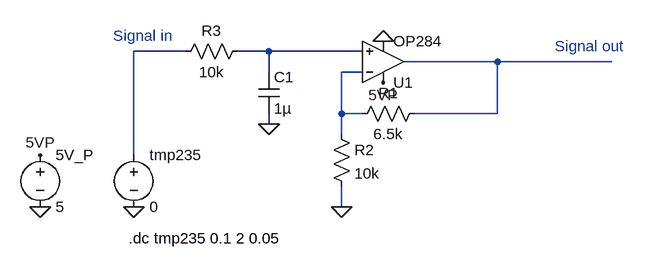
[diagram p0: schematic tmp235.asc]
tmp235.asc, the LTspice schematic file:
Version 4
SHEET 1 880 680
WIRE 80 48 0 48
WIRE 208 48 160 48
WIRE 352 48 208 48
WIRE 560 64 416 64
WIRE 736 64 560 64
WIRE 208 80 208 48
WIRE 352 80 320 80
WIRE 320 144 320 80
WIRE 352 144 320 144
WIRE 560 144 560 64
WIRE 560 144 432 144
WIRE 208 160 208 144
WIRE 320 176 320 144
WIRE 0 208 0 48
WIRE 320 288 320 256
FLAG 384 32 0
FLAG 0 288 0
FLAG -144 288 0
FLAG 320 288 0
FLAG 208 160 0
FLAG -144 208 5VP
FLAG 384 96 5VP
SYMBOL voltage 0 192 R0
WINDOW 123 0 0 Left 0
WINDOW 39 0 0 Left 0
SYMATTR InstName tmp235
SYMATTR Value 0
SYMBOL voltage -144 192 R0
WINDOW 123 0 0 Left 0
WINDOW 39 0 0 Left 0
SYMATTR InstName 5V_P
SYMATTR Value 5
SYMBOL Opamps\\OP284 384 128 M180
SYMATTR InstName U1
SYMBOL res 448 128 R90
WINDOW 0 0 56 VBottom 2
WINDOW 3 32 56 VTop 2
SYMATTR InstName R1
SYMATTR Value 6.5k
SYMBOL res 304 160 R0
SYMATTR InstName R2
SYMATTR Value 10k
SYMBOL res 176 32 R90
WINDOW 0 0 56 VBottom 2
WINDOW 3 32 56 VTop 2
SYMATTR InstName R3
SYMATTR Value 10k
SYMBOL cap 192 80 R0
SYMATTR InstName C1
SYMATTR Value 1µ
TEXT 648 40 Left 2 ;Signal out
TEXT -32 24 Left 2 ;Signal in
TEXT -8 336 Left 2 !.dc tmp235 0.1 2 0.05

The netlist it stands for:
* tmp235.asc
V§tmp235 N001 0 0
V§5V_P 5VP 0 5
XU1 N002 N004 5VP 0 N003 OP284  ; pins In+ In- V+ V- OUT
R1 N003 N004 6.5k
R2 N004 0 10k
R3 N002 N001 10k
C1 N002 0 1µ
* Signal out
* Signal in
.dc tmp235 0.1 2 0.05
.lib ADI1.lib
.backanno
.end